# Altium project Mix_v3.PrjPcb
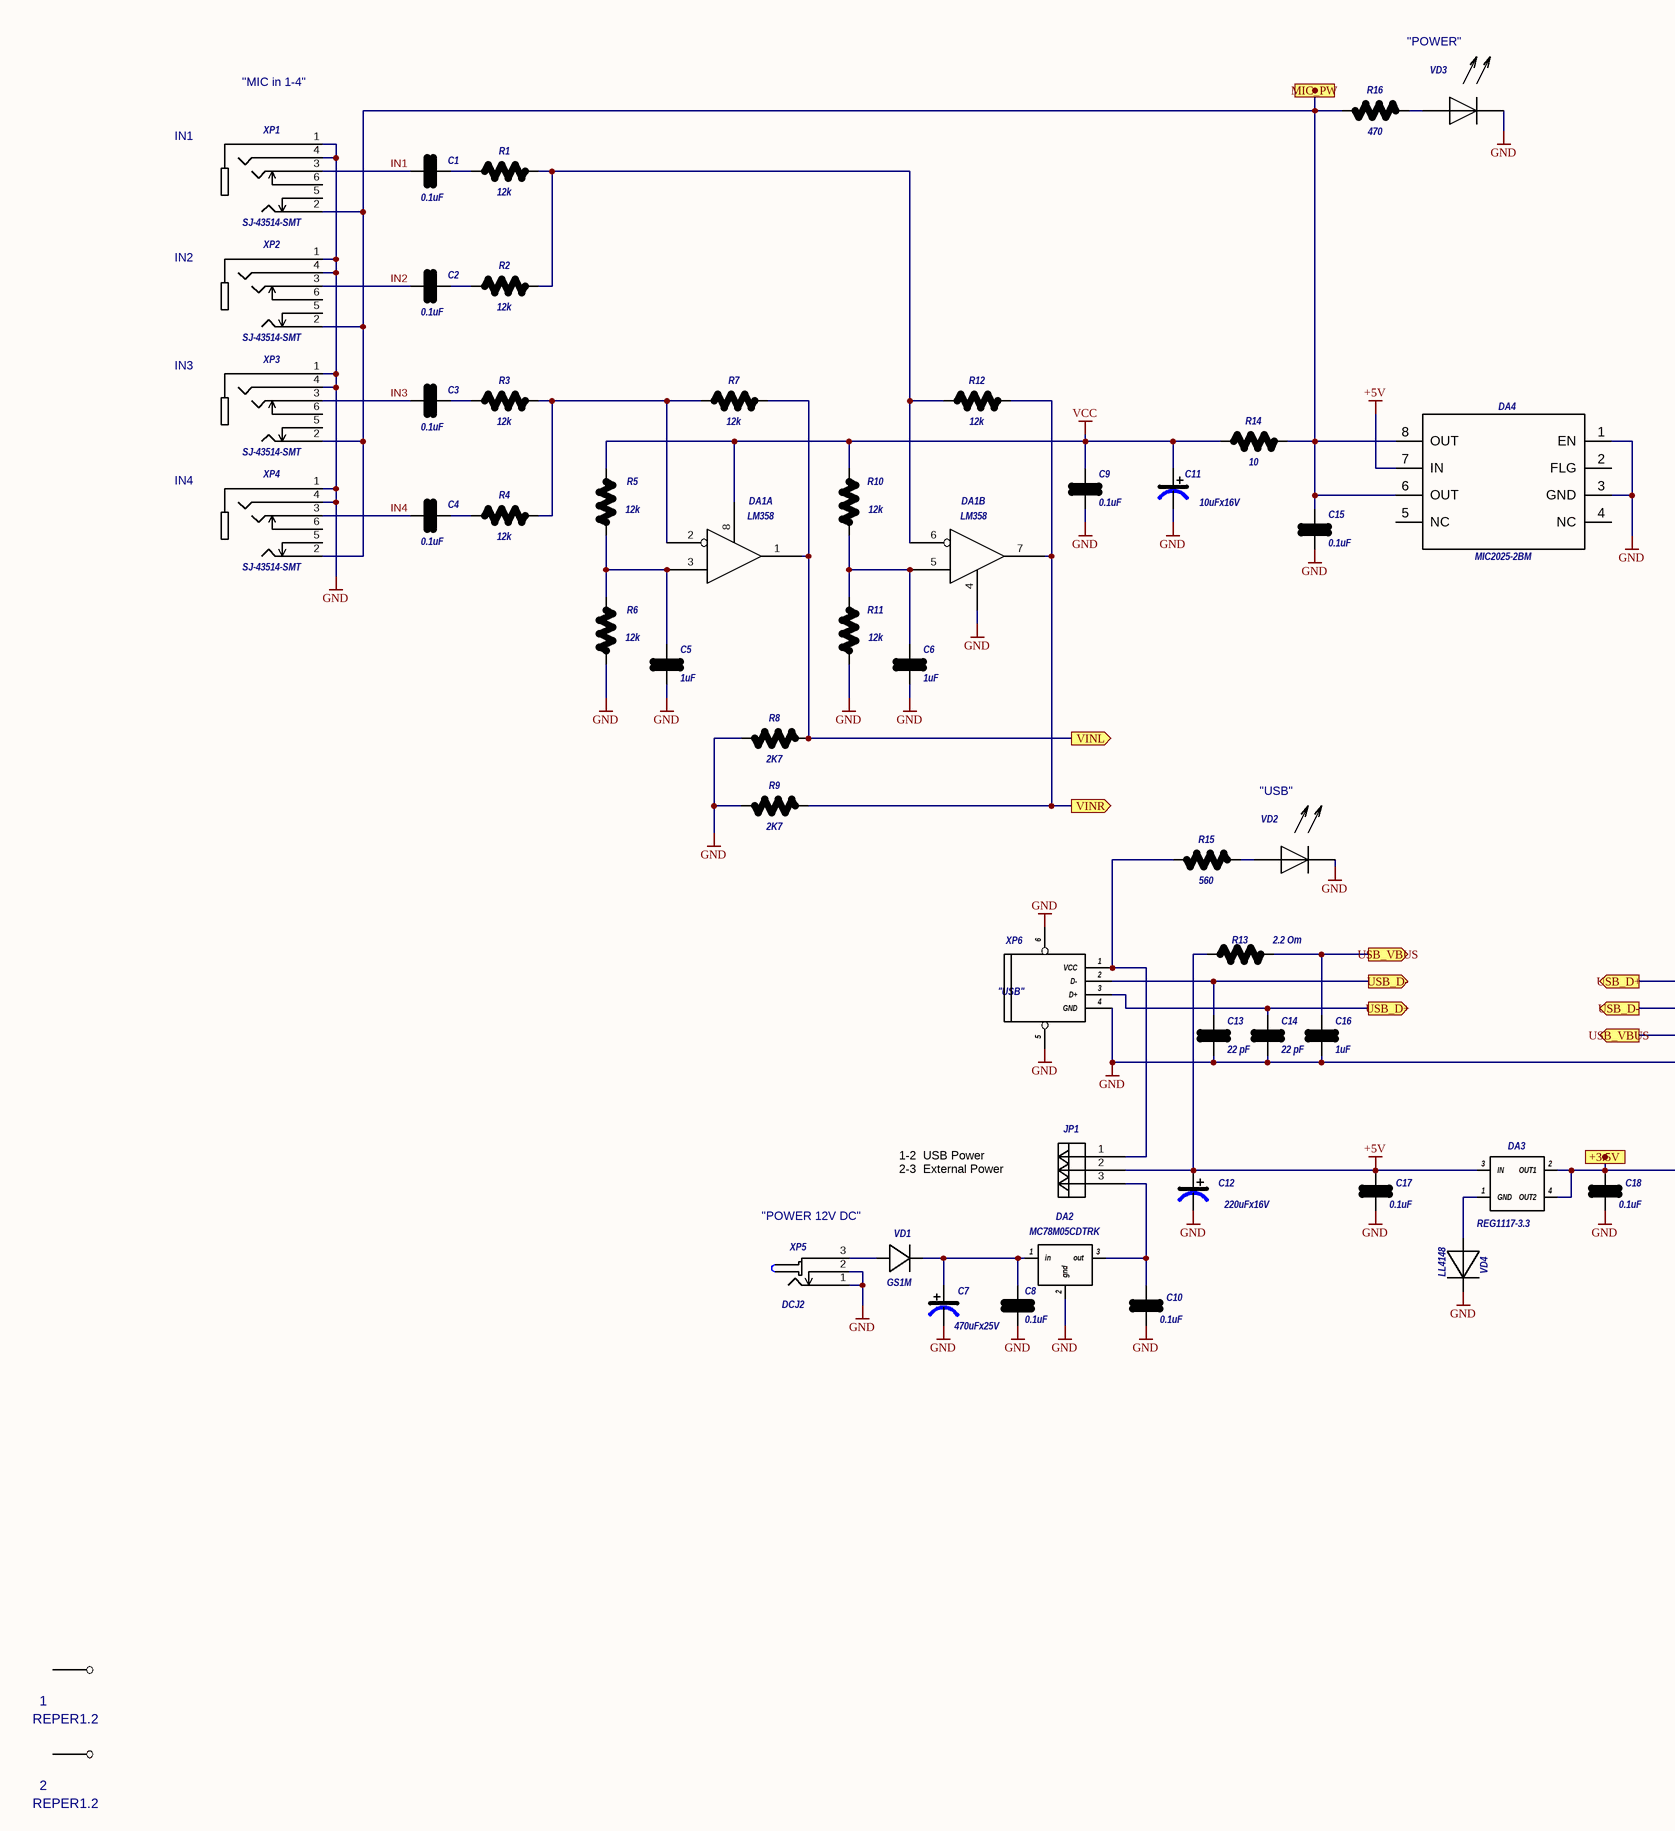
[diagram p0: Sheet1.SCHDOC, left]
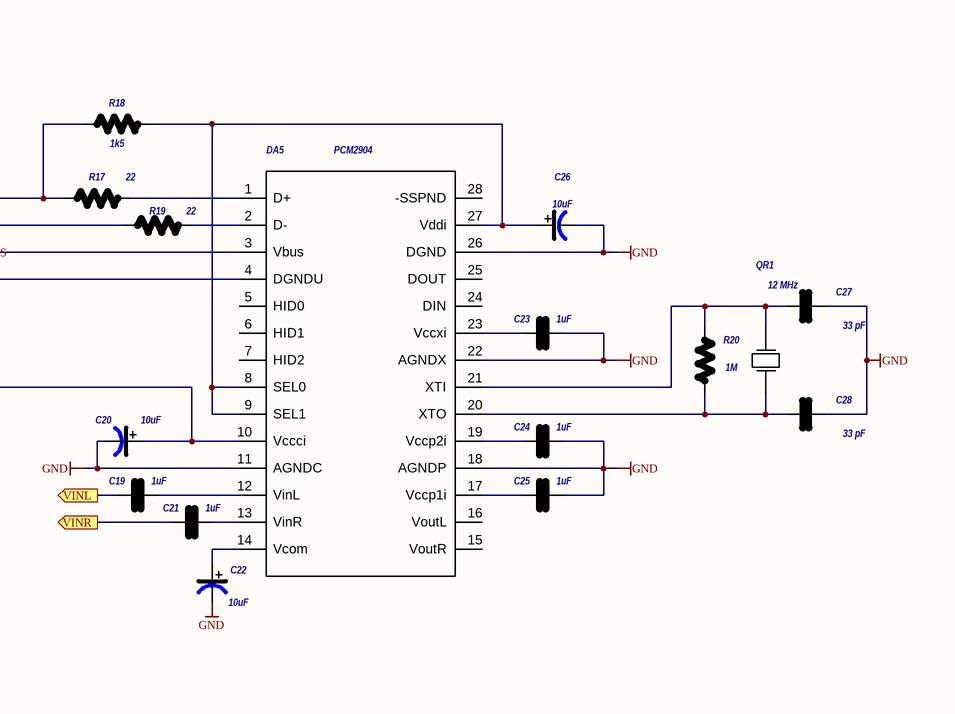
[diagram p1: Sheet1.SCHDOC, right]
1 sheet, 67 parts. Net scope: global (net labels, ports and power ports of the same name join across sheets).
Board file: mix_v3.PcbDoc

## Sheet Sheet1.SCHDOC: Microphone amplifier
size 840 x 593 mm; DrawnBy: Воробьёв; Revision: 1.0; SheetNumber: 1; SheetTotal: 1; PageSetup: Record=PageOptions|CenterHorizontal=True|CenterVertical=True|PrintScale=0.33|XCorrection=1.00|YCorrection=1.00|PrintKind=2|BorderSize=5000000|LeftOffset=0|BottomOffset=0|Orientation=2|PaperLength=1000|PaperWidth=1000|Scale=100|PaperSource=7|PrintQuality=-3|MediaType=1|DitherType=10|PrintScaleMode=1|PaperKind=A4|PaperIndex=9; DocumentName: Sheet1.SCHDOC

### Parts
1  REPER1.2  [REPER1.2]
2  REPER1.2  [REPER1.2]
C1  value 0.1uF  [CC0805-MIDI-2M1]  (hidden comment: CC0805)
C2  value 0.1uF  [CC0805-MIDI-2M1]  (hidden comment: CC0805)
C3  value 0.1uF  [CC0805-MIDI-2M1]  (hidden comment: CC0805)
C4  value 0.1uF  [CC0805-MIDI-2M1]  (hidden comment: CC0805)
C5  value 1uF  [CC0805-MIDI-2M1]  (hidden comment: CC0805)
C6  value 1uF  [CC0805-MIDI-2M1]  (hidden comment: CC0805)
C7  value 470uFx25V  [CC8X11]  (hidden comment: CC8X11)
C8  value 0.1uF  [CC0805-MIDI-2M1]  (hidden comment: CC0805)
C9  value 0.1uF  [CC0805-MIDI-2M1]  (hidden comment: CC0805)
C10  value 0.1uF  [CC0805-MIDI-2M1]  (hidden comment: CC0805)
C11  value 10uFx16V  [CC4X8]  (hidden comment: C4X8)
C12  value 220uFx16V  [CC8X11]  (hidden comment: CC8X11)
C13  value 22 pF  [CC0805-MIDI-2M1]  (hidden comment: CC0805)
C14  value 22 pF  [CC0805-MIDI-2M1]  (hidden comment: CC0805)
C15  value 0.1uF  [CC0805-MIDI-2M1]  (hidden comment: CC0805)
C16  value 1uF  [CC0805-MIDI-2M1]  (hidden comment: CC0805)
C17  value 0.1uF  [CC0805-MIDI-2M1]  (hidden comment: CC0805)
C18  value 0.1uF  [CC0805-MIDI-2M1]  (hidden comment: CC0805)
C19  value 1uF  [CC0805-MIDI-2M1]  (hidden comment: CC0805)
C20  value 10uF  [TAJ-A_M]  (hidden comment: TAJ-A)
C21  value 1uF  [CC0805-MIDI-2M1]  (hidden comment: CC0805)
C22  value 10uF  [TAJ-A_M]  (hidden comment: TAJ-A)
C23  value 1uF  [CC0805-MIDI-2M1]  (hidden comment: CC0805)
C24  value 1uF  [CC0805-MIDI-2M1]  (hidden comment: CC0805)
C25  value 1uF  [CC0805-MIDI-2M1]  (hidden comment: CC0805)
C26  value 10uF  [TAJ-A_M]  (hidden comment: TAJ-A)
C27  value 33 pF  [CC0805-MIDI-2M1]  (hidden comment: CC0805)
C28  value 33 pF  [CC0805-MIDI-2M1]  (hidden comment: CC0805)
DA1  LM358  [SO-8]  (parts A,B of 2)
DA2  MC78M05CDTRK  [D-PAK(TO-252AA)]
DA3  value REG1117-3.3  [SOT-223]  (hidden comment: REG1117-AJ)
DA4  MIC2025-2BM  [SO-8]
DA5  PCM2904  [TSSOP28]
JP1  JP3  [PIN3W]  (value not drawn)
QR1  value 12 MHz  [QR_LP_3_5]  (hidden comment: LP-3_5)
R1  value 12k  [RC0805_2]  (hidden comment: RC0805)
R2  value 12k  [RC0805_2]  (hidden comment: RC0805)
R3  value 12k  [RC0805_2]  (hidden comment: RC0805)
R4  value 12k  [RC0805_2]  (hidden comment: RC0805)
R5  value 12k  [RC0805_2]  (hidden comment: RC0805)
R6  value 12k  [RC0805_2]  (hidden comment: RC0805)
R7  value 12k  [RC0805_2]  (hidden comment: RC0805)
R8  value 2K7  [RC0805_2]  (hidden comment: RC0805)
R9  value 2K7  [RC0805_2]  (hidden comment: RC0805)
R10  value 12k  [RC0805_2]  (hidden comment: RC0805)
R11  value 12k  [RC0805_2]  (hidden comment: RC0805)
R12  value 12k  [RC0805_2]  (hidden comment: RC0805)
R13  value 2.2 Om  [RC0805_2]  (hidden comment: RC0805)
R14  value 10  [RC0805_2]  (hidden comment: RC0805)
R15  value 560  [RC0805_2]  (hidden comment: RC0805)
R16  value 470  [RC0805_2]  (hidden comment: RC0805)
R17  value 22  [RC0805_2]  (hidden comment: RC0805)
R18  value 1k5  [RC0805_2]  (hidden comment: RC0805)
R19  value 22  [RC0805_2]  (hidden comment: RC0805)
R20  value 1M  [RC0805_2]  (hidden comment: RC0805)
VD1  GS1M  [SMA]
VD2  LED_3  [LED3]  (value not drawn)
VD3  LED_3  [LED3]  (value not drawn)
VD4  LL4148  [SOD80]
XP1  SJ-43514-SMT  [SJ-43514-SMT]
XP2  SJ-43514-SMT  [SJ-43514-SMT]
XP3  SJ-43514-SMT  [SJ-43514-SMT]
XP4  SJ-43514-SMT  [SJ-43514-SMT]
XP5  value DCJ2  [DCJ25]  (hidden comment: DCJ25)
XP6  CN-USB-B  [USB-B]  (value not drawn)

### Ports
+3.5V, MIC_PW, USB_D+ (out), USB_D- (out), USB_VBUS (out), VINL (out), VINR (out)

### Nets
+5V: C12.1(plus) C17.2(B) DA3.3(IN) DA4.7(IN) JP1.2 R13.1
GND: C5.1(A) C6.1(A) C7.2(minus) C8.1(A) C9.1(A) C10.1(A) C11.2(minus) C12.2(minus) C13.1(A) C14.1(A) C15.1(A) C16.1(A) C17.1(A) C18.1(A) C20.2(B) C22.2(B) C23.2(B) C24.2(B) C25.2(B) C26.2(B) C27.2(B) C28.2(B) DA1.4(GND) DA2.2(gnd) DA4.1(EN) DA4.3(GND) DA5.4(DGNDU) DA5.11(AGNDC) DA5.18(AGNDP) DA5.22(AGNDX) DA5.26(DGND) R6.1 R8.2 R9.2 R11.1 VD2.1 VD3.1 VD4.2(+) XP1.1 XP1.4 XP2.1 XP2.4 XP3.1 XP3.4 XP4.1 XP4.4 XP5.1 XP5.2 XP6.4(GND) XP6.5 XP6.6
VCC: C9.2(B) C11.1(plus) DA1.8(VCC) R5.2 R10.2 R14.1
IN1: C1.1(A) XP1.3
IN2: C2.1(A) XP2.3
IN3: C3.1(A) XP3.3
IN4: C4.1(A) XP4.3
USB_D+: C14.2(B) R17.1 R18.1 XP6.3(D+) ; port USB_D+
USB_D-: C13.2(B) R19.1 XP6.2(D-) ; port USB_D-
USB_VBUS: C16.2(B) DA5.3(Vbus) R13.2 ; port USB_VBUS
VINL: C19.1(A) DA1.1(out) R7.2 R8.1 ; port VINL
VINR: C21.1(A) DA1.7(out) R9.1 R12.2 ; port VINR
NetC1_2: C1.2(B) R1.1
NetC2_2: C2.2(B) R2.1
NetC3_2: C3.2(B) R3.1
NetC4_2: C4.2(B) R4.1
NetC5_2: C5.2(B) DA1.3(+) R5.1 R6.2
NetC6_2: C6.2(B) DA1.5(+) R10.1 R11.2
NetC7_1: C7.1(plus) C8.2(B) DA2.1(in) VD1.2(K)
NetC10_2: C10.2(B) DA2.3(out) JP1.3
NetC15_2: C15.2(B) DA4.6(OUT) DA4.8(OUT) R14.2 R16.2 XP1.2 XP2.2 XP3.2 XP4.2
NetC18_2: C18.2(B) C20.1(A) DA3.2(OUT1) DA3.4(OUT2) DA5.10(Vccci)
NetC19_2: C19.2(B) DA5.12(VinL)
NetC21_2: C21.2(B) DA5.13(VinR)
NetC22_1: C22.1(A) DA5.14(Vcom)
NetC23_1: C23.1(A) DA5.23(Vccxi)
NetC24_1: C24.1(A) DA5.19(Vccp2i)
NetC25_1: C25.1(A) DA5.17(Vccp1i)
NetC26_1: C26.1(A) DA5.8(SEL0) DA5.9(SEL1) DA5.27(Vddi) R18.2
NetC27_1: C27.1(A) DA5.21(XTI) QR1.2 R20.2
NetC28_1: C28.1(A) DA5.20(XTO) QR1.1 R20.1
NetDA1_2: DA1.2(-) R3.2 R4.2 R7.1
NetDA1_6: DA1.6(-) R1.2 R2.2 R12.1
NetDA3_1: DA3.1(GND) VD4.1(-)
NetDA5_1: DA5.1(D+) R17.2
NetDA5_2: DA5.2(D-) R19.2
NetJP1_1: JP1.1 R15.2 XP6.1(VCC)
NetR15_1: R15.1 VD2.2
NetR16_1: R16.1 VD3.2
NetVD1_1: VD1.1(A) XP5.3

Not connected (* = marked no-connect by the designer): 1 1; 2 1; DA4 2(FLG) 4(NC) 5(NC); DA5 5(HID0) 6(HID1) 7(HID2) 15(VoutR) 16(VoutL) 24(DIN) 25(DOUT) 28(-SSPND); XP1 5 6 7 8; XP2 5 6 7 8; XP3 5 6 7 8; XP4 5 6 7 8

### Notes on the sheet
- "POWER"
- IN1
- (near XP1) "MIC in 1-4"
- IN2
- IN3
- IN4
- "USB"
- (near XP6) "USB"
- "POWER 12V DC"
- 1-2  USB Power
  2-3  External Power
- A
- B
- C
- D
- E
- F
- 1
- 2
- 3
- 4
- Title
- Size
- A2
- Number
- Rev
- Date
- Filename
- Drawn by
- Sheet
- of

### Library data of the parts
2 = REPER1.2_VARIANT_1: Value: *
C7 = CC8X11_VARIANT_1
C8 = CC0805_VARIANT_1
1 = REPER1.2: Value: *
DA1 = LM358: Value: *
DA2 = MC78M05CDTRK: Value: *
DA4 = MIC2025-2BM: Value: *
DA5 = PCM2904: Value: *
JP1 = JP3: Value: *
VD2 VD3 = LED_3: Value: *
XP1-XP4 = SJ-43514-SMT: Value: *
XP6 = CN-USB-B: Value: *